# EAGLE design RGBtlc (EAGLE 6.2)
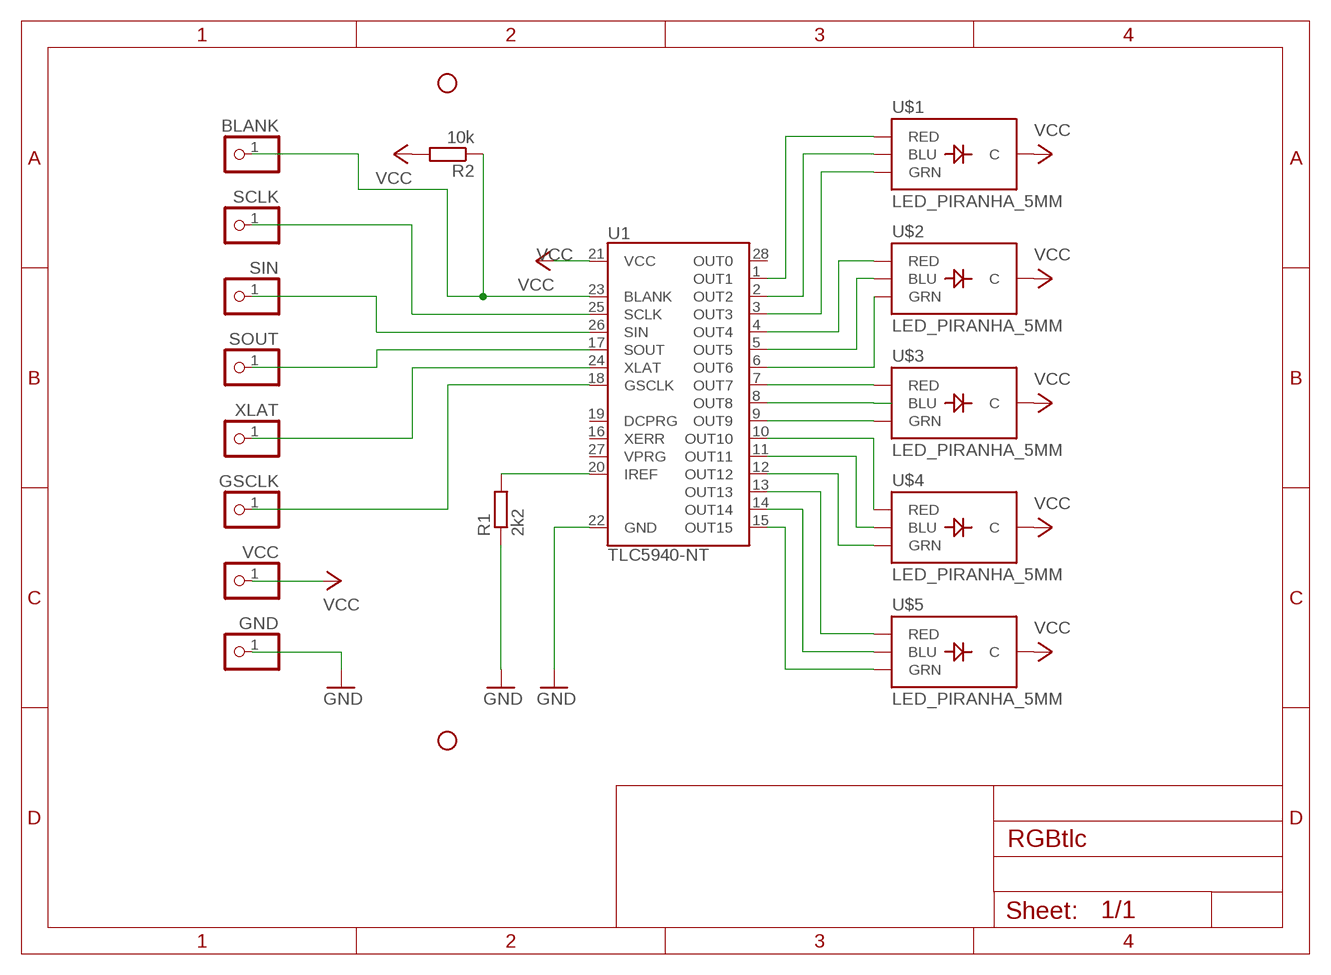
[diagram p0: schematic, sheet 1]

## Parts
BLANK  PINHD-1X1  [1X01]
GND  PINHD-1X1  [1X01]
GSCLK  PINHD-1X1  [1X01]
JP1  STAND-OFF  [STAND-OFF]
JP4  STAND-OFF  [STAND-OFF]
R1  2k2  R-EU_0207/7  [0207/7]
R2  10k  R-EU_0207/7  [0207/7]
SCLK  PINHD-1X1  [1X01]
SIN  PINHD-1X1  [1X01]
SOUT  PINHD-1X1  [1X01]
U1  TLC5940-NT  [DIL28-3]
U$1  LED_PIRANHA_5MM  [LED_PIRANHA_5MM]
U$2  LED_PIRANHA_5MM  [LED_PIRANHA_5MM]
U$3  LED_PIRANHA_5MM  [LED_PIRANHA_5MM]
U$4  LED_PIRANHA_5MM  [LED_PIRANHA_5MM]
U$5  LED_PIRANHA_5MM  [LED_PIRANHA_5MM]
VCC  PINHD-1X1  [1X01]
XLAT  PINHD-1X1  [1X01]

## Nets
GND: GND.1 R1.1 U1.22(GND)
N$1: U1.15(OUT15) U$5.G(GRN)
N$2: U1.14(OUT14) U$5.B(BLU)
N$3: U1.13(OUT13) U$5.R(RED)
N$4: U1.8(OUT8) U$3.B(BLU)
N$5: U1.12(OUT12) U$4.G(GRN)
N$6: U1.11(OUT11) U$4.B(BLU)
N$7: U1.10(OUT10) U$4.R(RED)
N$8: U1.9(OUT9) U$3.G(GRN)
N$9: BLANK.1 R2.1 U1.23(BLANK)
N$10: U1.7(OUT7) U$3.R(RED)
N$11: U1.6(OUT6) U$2.G(GRN)
N$12: U1.5(OUT5) U$2.B(BLU)
N$13: U1.4(OUT4) U$2.R(RED)
N$14: U1.3(OUT3) U$1.G(GRN)
N$15: U1.2(OUT2) U$1.B(BLU)
N$16: U1.1(OUT1) U$1.R(RED)
N$17: SCLK.1 U1.25(SCLK)
N$18: SIN.1 U1.26(SIN)
N$19: U1.24(XLAT) XLAT.1
N$20: GSCLK.1 U1.18(GSCLK)
N$21: SOUT.1 U1.17(SOUT)
N$22: R1.2 U1.20(IREF)
VCC: R2.2 U1.21(VCC) U$1.-(C) U$2.-(C) U$3.-(C) U$4.-(C) U$5.-(C) VCC.1
Unconnected: U1.16(XERR) U1.19(DCPRG) U1.27(VPRG) U1.28(OUT0)

## Library data of the parts
BLANK GND GSCLK SCLK SIN SOUT VCC XLAT = pinhead:PINHD-1X1: PIN HEADER
JP1 JP4 = SparkFun-Electromechanical:STAND-OFF: #4 Stand Off This is the mechanical footprint for a #4 phillips button head screw. Use the keepout ring to avoid running the screw head into surrounding components. SKU : PRT-00447
R1 R2 = rcl:R-EU_: RESISTOR, European symbol
U1 = SparkFun-DigitalIC:TLC5940: 16-channel LED Driver with Dot Correction and Grayscale PWM Control The TLC5940 is a 16-channel, constant-current sink LED driver. Each channel has an individually adjustable 4096-step grayscale PWM brightness control and a 64-step, constant-current sink (dot correction). The dot correction adjusts the brightness variations between LED channels and other LED drivers. The dot correction data is stored in an integrated EEPROM. Both grayscale control and dot correction are accessible via a serial interface. A single external resistor sets the maximum current value of all 16 channels. Packages: 28-pin HTSSOP 32-pin 5x5mm QFN 28-pin DIP
U$1-U$5 = SparkFun-LED:LED_PIRANHA_5MM: High-brightness RGB through-hole LED, similar to that used in the Shiftbrite

## Board
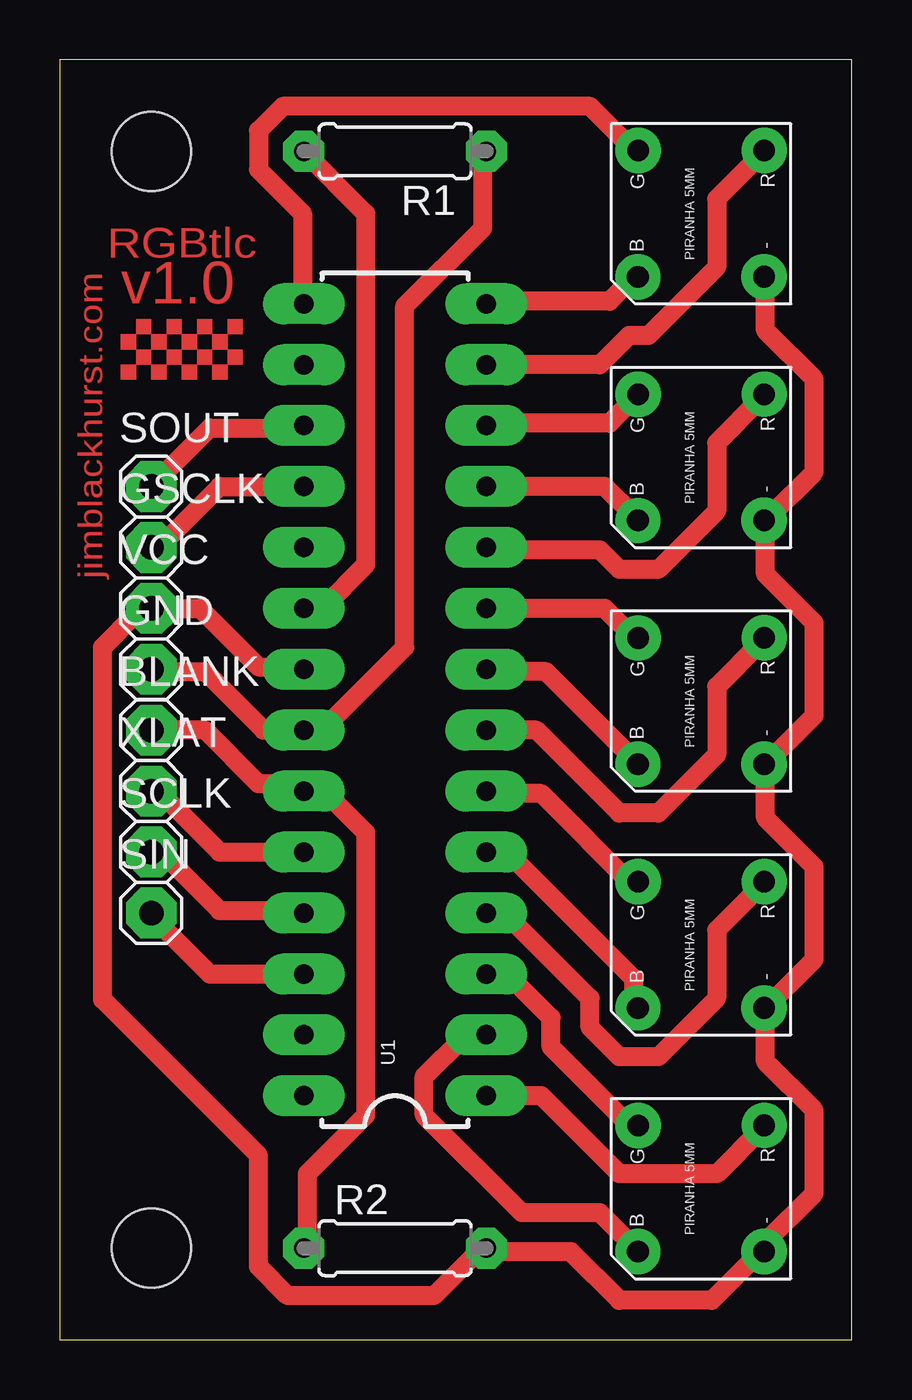
[diagram p1: board, top side]

Size 33.02 x 53.34 mm. Coordinates in mm from the lower left corner, seen from the top.
Outline: 0,0 33.02,0 33.02,53.34 0,53.34 0,0
Copper layers (1*16): Top 0.035mm / dielectric 1.5mm / Bottom 0.035mm
Design rules: minimum track width 0.8mm, minimum drill 0.8mm, track to track 0.8mm, track to pad 0.8mm, pad to pad 0.45mm, via to via 0.8mm, smd to smd 8mil, copper to edge 40mil, drill to drill 8mil, minimum pad ring 0.1mm, minimum via ring 8mil, stop-mask expansion 4mil, vias tented up to drill 0mil, thermal gap 10mil

### Footprints (pad centres in the part's own frame; a part is rotated, then mirrored left to right if it is on the bottom)
1X01 = drill 1.016 octagon: 1 0,0
STAND-OFF = hole 3.302: 0,0
0207/7 = drill 0.813 octagon: 1 -3.81,0; 2 3.81,0
DIL28-3 = drill 0.813 long: 1 -16.51,-3.81; 2 -13.97,-3.81; 3 -11.43,-3.81; 4 -8.89,-3.81; 5 -6.35,-3.81; 6 -3.81,-3.81; 7 -1.27,-3.81; 8 1.27,-3.81; 9 3.81,-3.81; 10 6.35,-3.81; 11 8.89,-3.81; 12 11.43,-3.81; 13 13.97,-3.81; 14 16.51,-3.81; 15 16.51,3.81; 16 13.97,3.81; 17 11.43,3.81; 18 8.89,3.81; 19 6.35,3.81; 20 3.81,3.81; 21 1.27,3.81; 22 -1.27,3.81; 23 -3.81,3.81; 24 -6.35,3.81; 25 -8.89,3.81; 26 -11.43,3.81; 27 -13.97,3.81; 28 -16.51,3.81
LED_PIRANHA_5MM = drill 0.9: - -2.684,-2.684; B -2.688,2.574; G 2.575,2.562; R 2.579,-2.696

### Placement (x,y rotation side)
BLANK  3.81,25.4 0 top
GND  3.81,27.94 0 top
GSCLK  3.81,33.02 0 top
JP1  3.81,49.53 0 top
JP4  3.81,3.81 0 top
R1  13.97,49.53 180 top
R2  13.97,3.81 0 top
SCLK  3.81,20.32 0 top
SIN  3.81,17.78 0 top
SOUT  3.81,35.56 0 top
U1  13.97,26.67 90 top
U$1  26.67,6.35 90 top
U$2  26.67,16.51 90 top
U$3  26.67,26.67 90 top
U$4  26.67,36.83 90 top
U$5  26.67,46.99 90 top
VCC  3.81,30.48 0 top
XLAT  3.81,22.86 0 top

### Tracks (layer width: path | path; a pad name or v marks a point on that pad's centre or on a via)
GND
  Top 0.8: GND.1 3.81,27.84 6.05,27.84 8.48,25.4 U1.22 10.52,25.6 11.12,25.6 14.38,28.85 14.38,43.08 17.63,46.33 17.63,49.38 R1.1
N$1
  Top 0.8: U1.15 10.11,43.28 10.11,46.94 8.28,48.77 8.28,50.39 9.3,51.41 22.1,51.41 23.93,49.58 U$5.G
N$2
  Top 0.8: U1.14 17.83,43.28 22.91,43.28 23.93,44.3 U$5.B
N$3
  Top 0.8: U1.13 22.5,40.64 23.72,41.86 24.54,41.86 27.38,44.7 27.38,47.55 29.21,49.38 U$5.R
N$4
  Top 0.8: U1.8 17.83,27.84 20.27,27.84 23.93,24.18 U$3.B
N$5
  Top 0.8: U1.12 17.83,38.2 22.91,38.2 23.93,39.22 U$4.G
N$6
  Top 0.8: U1.11 22.71,35.56 23.93,34.34 U$4.B
N$7
  Top 0.8: U1.10 17.83,32.92 22.5,32.92 23.32,32.11 24.94,32.11 27.38,34.54 27.38,37.39 29.21,39.22 U$4.R
N$8
  Top 0.8: U1.9 22.71,30.48 23.93,29.26 U$3.G
N$9
  Top 0.8: R2.1 10.31,3.86 10.31,6.91 12.75,9.35 12.75,21.13 11.12,22.76 10.31,22.76 U1.23 9.91,23.16 8.28,23.16 6.05,25.4 BLANK.1
N$10
  Top 0.8: U1.7 19.86,25.4 23.32,21.95 24.94,21.95 27.38,24.38 27.38,27.23 29.21,29.06 U$3.R
N$11
  Top 0.8: U1.6 17.83,22.76 20.07,22.76 23.93,18.9 U$2.G
N$12
  Top 0.8: U1.5 18.64,20.32 23.93,15.04 23.93,14.02 U$2.B
N$13
  Top 0.8: U1.4 17.83,17.68 18.64,17.68 22.1,14.22 22.1,13.01 23.32,11.79 24.94,11.79 27.38,14.22 27.38,17.07 29.21,18.9 U$2.R
N$14
  Top 0.8: U1.3 18.64,15.24 20.47,13.41 20.47,12.19 23.93,8.74 U$1.G
N$15
  Top 0.8: U1.2 17.63,12.6 16.81,12.6 15.19,10.97 15.19,9.35 19.25,5.28 22.5,5.28 23.93,3.86 U$1.B
N$16
  Top 0.8: U1.1 20.07,10.16 23.32,6.91 27.38,6.91 29.21,8.74 U$1.R
N$17
  Top 0.8: SCLK.1 4.22,20.32 6.66,17.88 10.11,17.88 U1.25
N$18
  Top 0.8: U1.26 6.25,15.24 3.81,17.68 SIN.1
N$19
  Top 0.8: U1.24 6.66,20.32 4.22,22.76 3.81,22.76 XLAT.1
N$20
  Top 0.8: U1.18 6.66,35.56 4.22,33.12 3.81,33.12 GSCLK.1
N$21
  Top 0.8: SOUT.1 6.25,38 10.11,38 U1.17
N$22
  Top 0.8: U1.20 10.92,30.48 12.75,32.31 12.75,46.94 R1.2
VCC
  Top 0.8: U1.21 10.11,28.04 8.28,28.04 5.84,30.48 VCC.1 3.61,30.28 3.2,30.28 1.78,28.85 1.78,14.17 8.28,7.67 8.28,3.05 9.5,1.83 15.6,1.83 17.42,3.66 R2.2 17.83,3.66 21.28,3.66 23.32,1.63 27.18,1.63 29.21,3.66 U$1.- 29.41,4.06 31.45,6.1 31.45,9.55 29.41,11.58 29.41,13.82 U$2.- 29.62,14.02 31.45,15.85 31.45,19.71 29.41,21.74 29.41,23.98 U$3.- 29.62,24.18 31.45,26.01 31.45,29.87 29.41,31.9 29.41,34.14 U$4.- 29.62,34.34 31.45,36.17 31.45,40.03 29.41,42.06 29.41,44.3 U$5.-
(copper drawn outside any net)
  shapes: Top area x16

### Text on the board
Top: RGBtlc | v1.0 | jimblackhurst.com